# EAGLE design Driver Controls Board v1.4 (EAGLE 9.5.1)
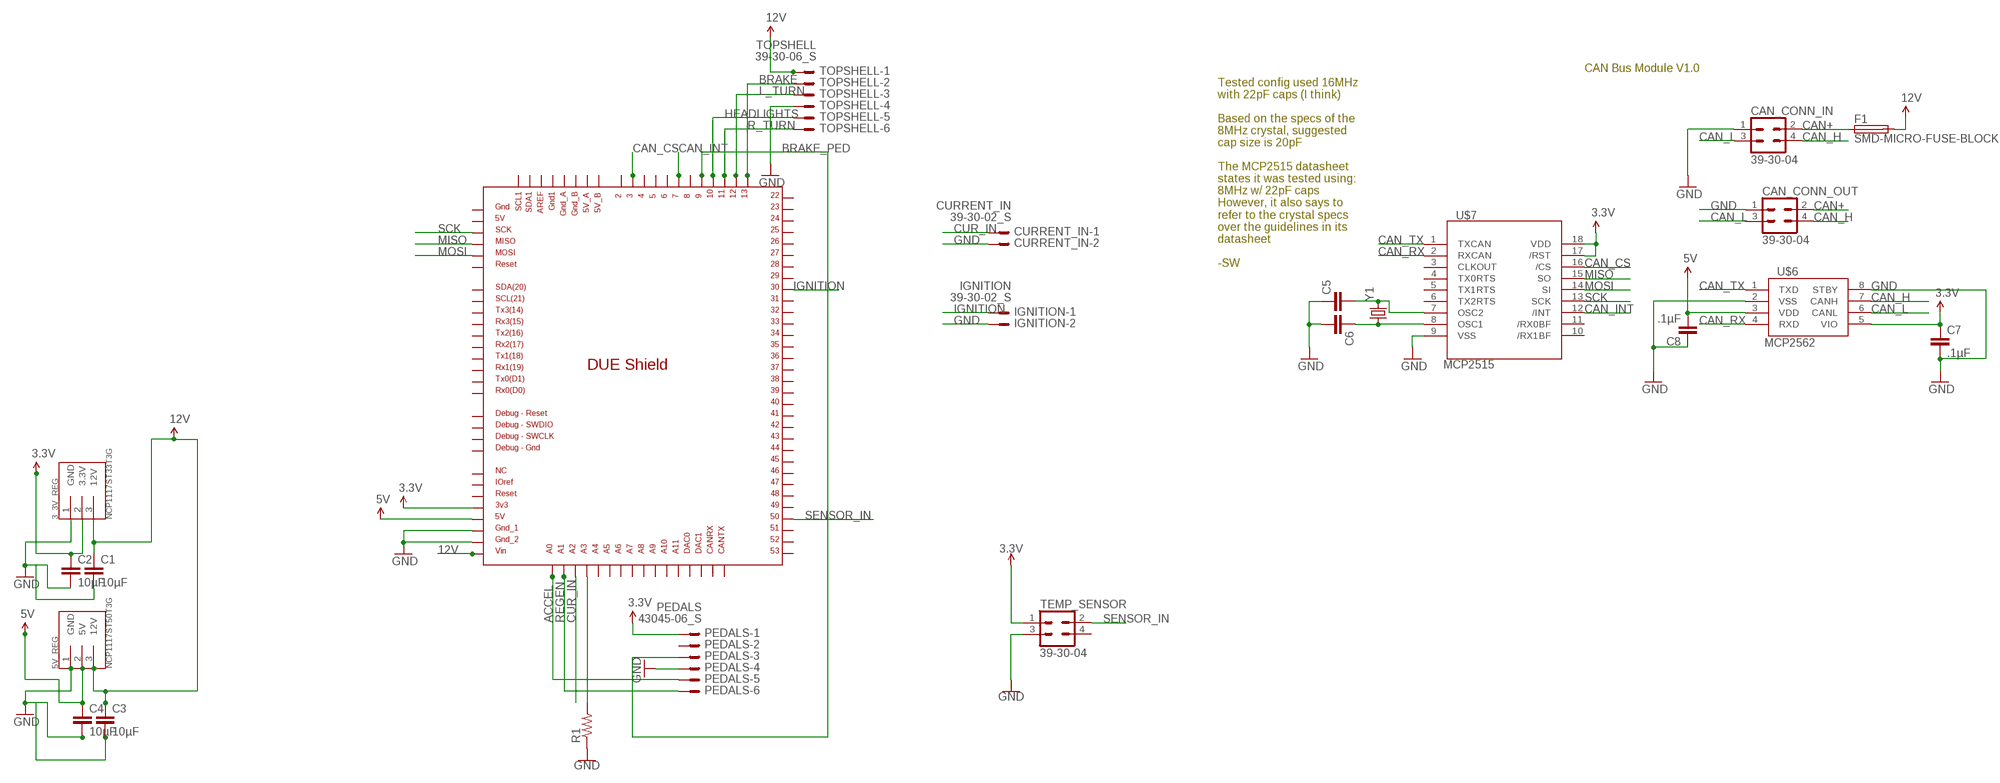
[diagram p0: schematic, sheet 1]

## Parts
3_3V_REG  NCP1117ST33T3G  [SOT223]
5V_REG  NCP1117ST50T3G  [SOT223]
C1  10µF  CAP0805  [0805]
C2  10µF  CAP0805  [0805]
C3  10µF  CAP0805  [0805]
C4  10µF  CAP0805  [0805]
C5  CAP0805  [0805]
C6  CAP0805  [0805]
C7  .1µF  CAP0805  [0805]
C8  .1µF  CAP0805  [0805]
CAN_CONN_IN  39-30-04  [39-30-?04?]
CAN_CONN_OUT  39-30-04  [39-30-?04?]
CURRENT_IN  39-30-02_S  [39-30-?02?]
F1  SMD-MICRO-FUSE-BLOCK  [OMNIBLOK]
IGNITION  39-30-02_S  [39-30-?02?]
PEDALS  43045-06_S  [43045-06]
R1  R-US_0204/5  [0204/5]
TEMP_SENSOR  39-30-04  [39-30-?04?]
TOPSHELL  39-30-06_S  [39-30-?06?]
U$2  DUE(NORMAL)  [DUE(NORMAL)]
U$6  MCP2562  [SOIC8]
U$7  MCP2515  [SO-18W]
Y1  CRYSTALHC49US  [HC49US]

## Nets
3.3V: 3_3V_REG.2(3.3V) C2.1 C7.1 PEDALS.1 TEMP_SENSOR.1 U$2.3V3 U$6.5(VIO) U$7.17(/RST) U$7.18(VDD)
5V: 5V_REG.2(5V) C4.1 C8.2 U$2.5V U$6.3(VDD)
12V: 3_3V_REG.3(12V) 5V_REG.3(12V) C1.1 C3.1 F1.P$2 TOPSHELL.1 U$2.VIN
ACCEL: PEDALS.5 U$2.A0
BRAKE: TOPSHELL.2 U$2.13
BRAKE_PED: PEDALS.3 U$2.9
CAN+: CAN_CONN_IN.2 CAN_CONN_OUT.2 F1.P$1
CAN_CS: U$2.3 U$7.16(/CS)
CAN_H: CAN_CONN_IN.4 CAN_CONN_OUT.4 U$6.7(CANH)
CAN_INT: U$2.7 U$7.12(/INT)
CAN_L: CAN_CONN_IN.3 CAN_CONN_OUT.3 U$6.6(CANL)
CAN_RX: U$6.4(RXD) U$7.2(RXCAN)
CAN_TX: U$6.1(TXD) U$7.1(TXCAN)
CUR_IN: CURRENT_IN.1 U$2.A2
GND: 3_3V_REG.1(GND) 5V_REG.1(GND) C1.2 C2.2 C3.2 C4.2 C5.1 C6.2 C7.2 C8.1 CAN_CONN_IN.1 CAN_CONN_OUT.1 CURRENT_IN.2 IGNITION.2 PEDALS.4 R1.1 TEMP_SENSOR.3 TOPSHELL.4 U$2.GND_1 U$2.GND_2 U$6.2(VSS) U$6.8(STBY) U$7.9(VSS)
HEADLIGHTS: TOPSHELL.5 U$2.10
IGNITION: IGNITION.1 U$2.30
L_TURN: TOPSHELL.3 U$2.12
MISO: U$2.MISO_ICSP U$7.15(SO)
MOSI: U$2.MOSI_ICSP U$7.14(SI)
N$1: R1.2 U$2.A3
N$7: C5.2 U$7.7(OSC2) Y1.2
N$11: C6.1 U$7.8(OSC1) Y1.1
R_TURN: TOPSHELL.6 U$2.11
REGEN: PEDALS.6 U$2.A1
SCK: U$2.SCK_ICSP U$7.13(SCK)
SENSOR_IN: TEMP_SENSOR.2 U$2.50
Unconnected: PEDALS.2 TEMP_SENSOR.4 U$2.2 U$2.4 U$2.5 U$2.5V_A U$2.5V_B U$2.5V_ICSP U$2.6 U$2.8 U$2.22 U$2.23 U$2.24 U$2.25 U$2.26 U$2.27 U$2.28 U$2.29 U$2.31 U$2.32 U$2.33 U$2.34 U$2.35 U$2.36 U$2.37 U$2.38 U$2.39 U$2.40 U$2.41 U$2.42 U$2.43 U$2.44 U$2.45 U$2.46 U$2.47 U$2.48 U$2.49 U$2.51 U$2.52 U$2.53 U$2.A4 U$2.A5 U$2.A6 U$2.A7 U$2.A8 U$2.A9 U$2.A10 U$2.A11 U$2.AREF U$2.CANRX U$2.CANTX U$2.DAC0 U$2.DAC1 U$2.GND1 U$2.GND_A U$2.GND_B U$2.GND_DEBUG U$2.GND_ICSP U$2.IOREF U$2.NC U$2.RESET U$2.RESET_DEBUG U$2.RESET_ICSP U$2.RX0 U$2.RX1 U$2.RX2 U$2.RX3 U$2.SCL U$2.SCL1 U$2.SDA U$2.SDA1 U$2.SWCLK_DEBUG U$2.SWDIO_DEBUG U$2.TX0 U$2.TX1 U$2.TX2 U$2.TX3 U$7.3(CLKOUT) U$7.4(TX0RTS) U$7.5(TX1RTS) U$7.6(TX2RTS) U$7.10(/RX1BF) U$7.11(/RX0BF)

## Notes on the sheet
- CAN Bus Module V1.0
- Tested config used 16MHz
  with 22pF caps (I think)
  
  Based on the specs of the
  8MHz crystal, suggested
  cap size is 20pF
  
  The MCP2515 datasheet
  states it was tested using:
  8MHz w/ 22pF caps
  However, it also says to
  refer to the crystal specs
  over the guidelines in its
  datasheet
  
  -SW

## Library data of the parts
3_3V_REG = NUSOLAR_Custom:NCP1117ST33T3G
5V_REG = NUSOLAR_Custom:NCP1117ST50T3G
C1-C8 = SparkFun-Capacitors:CAP: Capacitor Standard 0603 ceramic capacitor, and 0.1" leaded capacitor.
CAN_CONN_IN CAN_CONN_OUT TEMP_SENSOR = con-molex-mini-fit:39-30-?04?: HEADER
CURRENT_IN IGNITION = con-molex-mini-fit:39-30-?02?_S: HEADER
F1 = f-lf-omniblok-s:SMD-MICRO-FUSE
PEDALS = con-molex-micro-fit:43045-06_S: HEADER
R1 = resistor:R-US_: RESISTOR, American symbol
TOPSHELL = con-molex-mini-fit:39-30-?06?_S: HEADER
U$2 = DUElib130425:DUE(NORMAL)
U$6 = NUSOLAR_Custom:MCP2562
U$7 = NUSOLAR_Custom:MCP2515
Y1 = SparkFun-FreqCtrl:CRYSTAL: Various standard crystals. Proven footprints.

## Board
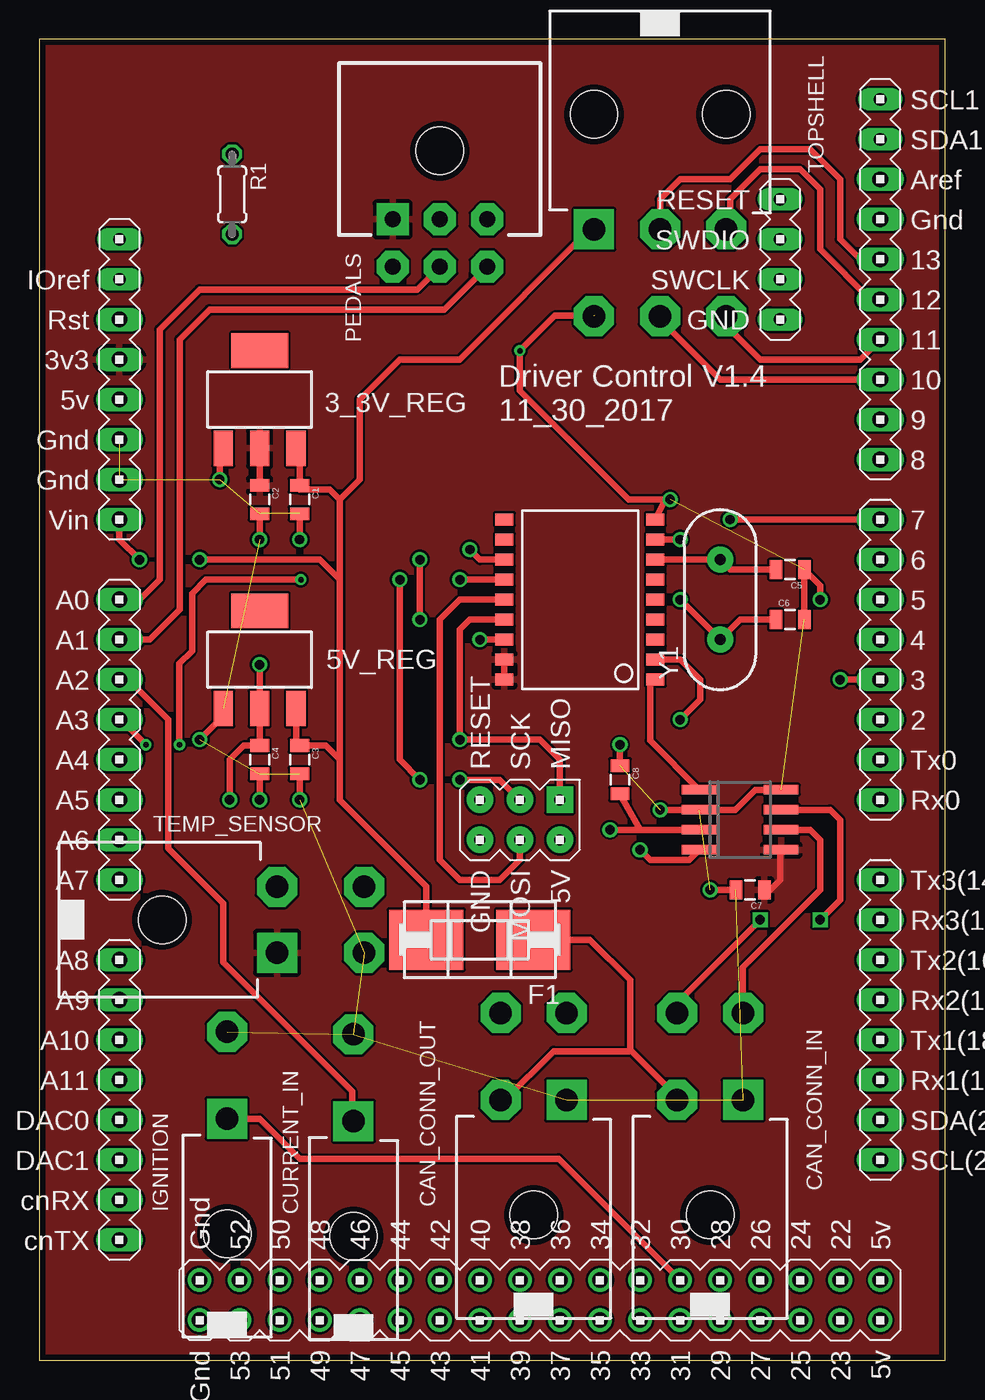
[diagram p1: board, top side]
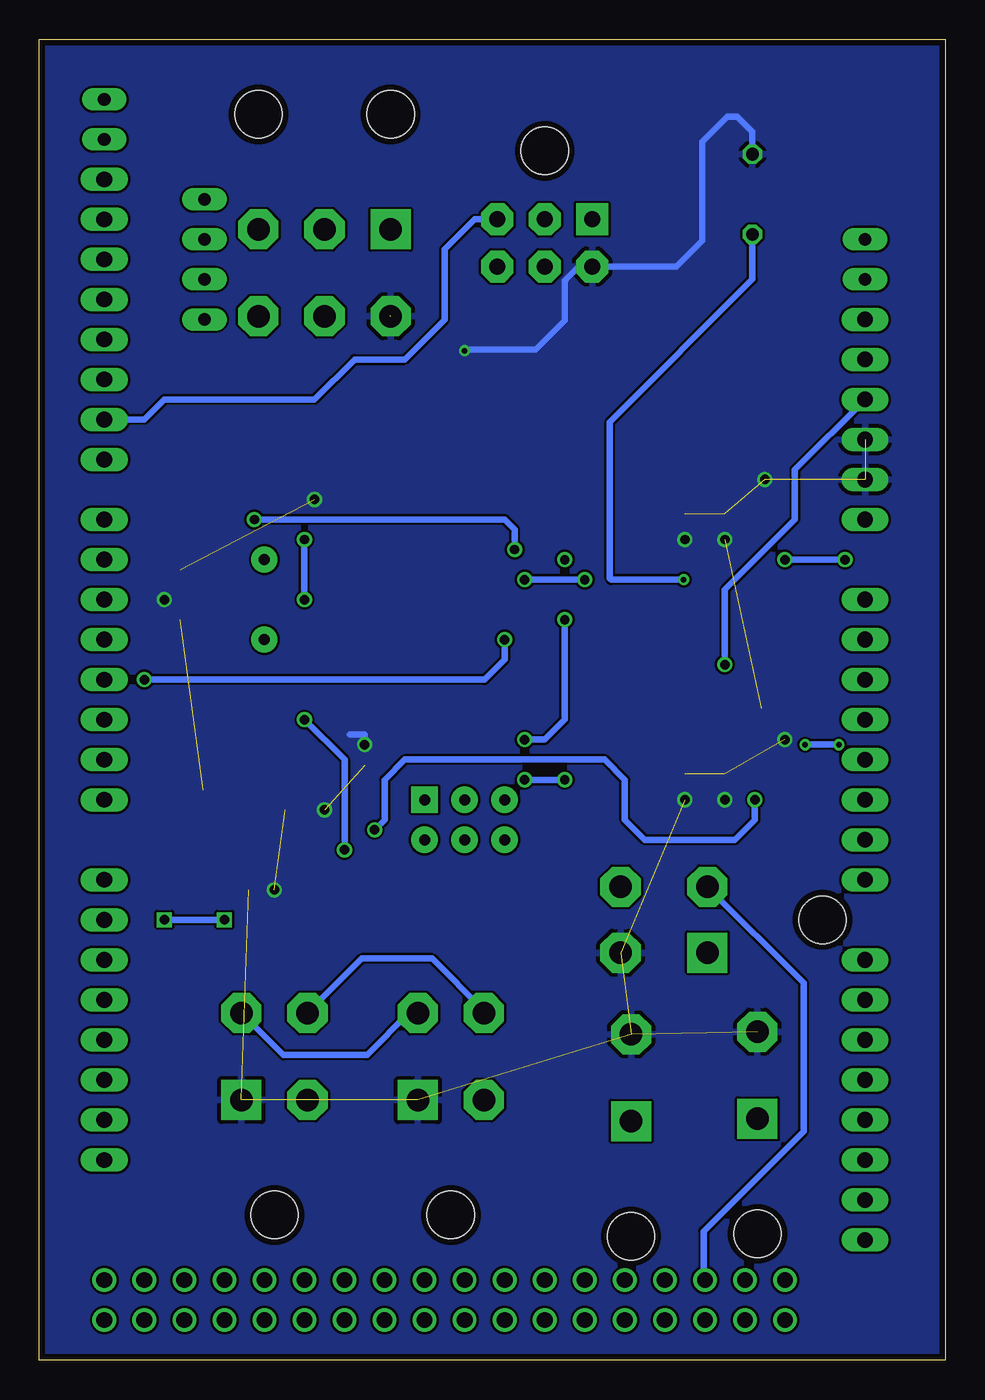
[diagram p2: board, bottom side, seen from below]

Size 57.45 x 83.81 mm. Coordinates in mm from the lower left corner, seen from the top.
Outline: 0,0 57.45,0 57.45,83.81 0,83.81 0,0
Copper layers (1*16): Top 0.0356mm / dielectric 1.5011mm / Bottom 0.0356mm
Design rules "LaenPCBOrder": minimum track width 6mil, minimum drill 13mil, track to track 6mil, track to pad 6mil, pad to pad 6mil, via to via 6mil, smd to smd 6mil, copper to edge 15mil, drill to drill 6mil, minimum pad ring 7mil, minimum via ring 7mil, stop-mask expansion 3mil, vias tented up to drill 0mil, thermal gap 10mil

### Footprints (pad centres in the part's own frame; a part is rotated, then mirrored left to right if it is on the bottom)
SOT223 = smd 1.219 x 2.235: 1 -2.311,-3.099; 2 0,-3.099; 3 2.311,-3.099 | smd 3.6 x 2.2: 4 0,3.099
0805 = smd 0.8 x 1.2: 1 -0.9,0; 2 0.9,0
39-30-?04? = drill 1.422 pad 2.54 square: 1 2.095,0 | drill 1.422 pad 2.54 octagon: 2 -2.095,0; 3 2.095,5.512; 4 -2.095,5.512 | hole 3: 0,-7.3
39-30-?02? = drill 1.422 pad 2.54 square: 1 0,0 | drill 1.422 pad 2.54 octagon: 2 0,5.512 | hole 3: 0,-7.3
OMNIBLOK = smd 4.7 x 3.8: P$1 -3.4,0; P$2 3.4,0
43045-06 = drill 1.016 pad 2.032 square: 1 3,0 | drill 1.016 pad 2.032 octagon: 2 0,0; 3 -3,0; 4 3,3; 5 0,3; 6 -3,3 | hole 3: 0,-4.35
0204/5 = drill 0.813 octagon: 1 -2.54,0; 2 2.54,0
39-30-?06? = drill 1.422 pad 2.54 square: 1 4.191,0 | drill 1.422 pad 2.54 octagon: 2 0,0; 3 -4.191,0; 4 4.191,5.512; 5 0,5.512; 6 -4.191,5.512 | hole 3: -4.191,-7.3; 4.191,-7.3
DUE(NORMAL) = drill 1 long: 2 -16.51,30.48; 3 -19.05,30.48; 3V3 -39.37,-17.78; 4 -21.59,30.48; 5 -24.13,30.48; 5V -36.83,-17.78; 6 -26.67,30.48; 7 -29.21,30.48; 8 -33.02,30.48; 9 -35.56,30.48; 10 -38.1,30.48; 11 -40.64,30.48; 12 -43.18,30.48; 13 -45.72,30.48; A0 -24.13,-17.78; A1 -21.59,-17.78; A2 -19.05,-17.78; A3 -16.51,-17.78; A4 -13.97,-17.78; A5 -11.43,-17.78; A6 -8.89,-17.78; A7 -6.35,-17.78; A8 -1.27,-17.78; A9 1.27,-17.78; A10 3.81,-17.78; A11 6.35,-17.78; AREF -50.8,30.48; CANRX 13.97,-17.78; CANTX 16.51,-17.78; DAC0 8.89,-17.78; DAC1 11.43,-17.78; GND1 -48.26,30.48; GND_1 -34.29,-17.78; GND_2 -31.75,-17.78; RESET -41.91,-17.78; RX0 -11.43,30.48; RX1 6.35,30.48; RX2 1.27,30.48; RX3 -3.81,30.48; SCL 11.43,30.48; SDA 8.89,30.48; TX0 -13.97,30.48; TX1 3.81,30.48; TX2 -1.27,30.48; TX3 -6.35,30.48; VIN -29.21,-17.78 | drill 1: 5V_A 19.05,30.48; 5V_B 21.59,30.48; 22 19.05,27.94; 23 21.59,27.94; 24 19.05,25.4; 25 21.59,25.4; 26 19.05,22.86; 27 21.59,22.86; 28 19.05,20.32; 29 21.59,20.32; 30 19.05,17.78; 31 21.59,17.78; 32 19.05,15.24; 33 21.59,15.24; 34 19.05,12.7; 35 21.59,12.7; 36 19.05,10.16; 37 21.59,10.16; 38 19.05,7.62; 39 21.59,7.62; 40 19.05,5.08; 41 21.59,5.08; 42 19.05,2.54; 43 21.59,2.54; 44 19.05,0; 45 21.59,0; 46 19.05,-2.54; 47 21.59,-2.54; 48 19.05,-5.08; 49 21.59,-5.08; 50 19.05,-7.62; 51 21.59,-7.62; 52 19.05,-10.16; 53 21.59,-10.16; GND_A 19.05,-12.7; GND_B 21.59,-12.7 | drill 0.7 pad 1.676: 5V_ICSP -8.89,5.08; GND_ICSP -8.89,10.16; MOSI_ICSP -8.89,7.62; RESET_ICSP -11.43,5.08; SCK_ICSP -11.43,7.62 | drill 0.8 pad 1.422 long: GND_DEBUG -41.91,24.13; IOREF -44.45,-17.78; NC -46.99,-17.78; RESET_DEBUG -49.53,24.13; SCL1 -55.88,30.48; SDA1 -53.34,30.48; SWCLK_DEBUG -44.45,24.13; SWDIO_DEBUG -46.99,24.13 | drill 0.7 pad 1.676 square: MISO_ICSP -11.43,10.16
SOIC8 = smd 0.6 x 2.2: 1 -1.905,-2.6; 2 -0.635,-2.6; 3 0.635,-2.6; 4 1.905,-2.6; 5 1.905,2.6; 6 0.635,2.6; 7 -0.635,2.6; 8 -1.905,2.6
SO-18W = smd 0.762 x 1.143: 1 -5.08,-4.788; 2 -3.81,-4.788; 3 -2.54,-4.788; 4 -1.27,-4.788; 5 0,-4.788; 6 1.27,-4.788; 7 2.54,-4.788; 8 3.81,-4.788; 9 5.08,-4.788; 10 5.08,4.788; 11 3.81,4.788; 12 2.54,4.788; 13 1.27,4.788; 14 0,4.788; 15 -1.27,4.788; 16 -2.54,4.788; 17 -3.81,4.788; 18 -5.08,4.788
HC49US = drill 0.7 pad 1.651: 1 -2.54,0; 2 2.54,0

### Placement (x,y rotation side)
3_3V_REG  13.97,60.96 0 top
5V_REG  13.97,44.45 0 top
C1  16.51,54.61 270 top
C2  13.97,54.61 270 top
C3  16.51,38.1 270 top
C4  13.97,38.1 270 top
C5  47.62,50.16 180 top
C6  47.62,46.99 0 top
C7  45.09,29.84 180 top
C8  36.83,36.83 270 top
CAN_CONN_IN  39-30-04?  [39-30-?04?]  42.55,16.51 0 top
CAN_CONN_OUT  39-30-04?  [39-30-?04?]  31.35,16.51 0 top
CURRENT_IN  39-30-02?_S  [39-30-?02?]  19.92,15.16 0 top
F1  27.94,26.67 180 top
IGNITION  39-30-02?_S  [39-30-?02?]  11.91,15.32 0 top
PEDALS  25.4,72.39 180 top
R1  12.22,73.98 270 top
TEMP_SENSOR  39-30-04?  [39-30-?04?]  15.08,27.94 270 top
TOPSHELL  39-30-06?_S  [39-30-?06?]  39.37,71.75 180 top
U$2  22.86,24.13 270 top
U$6  44.45,34.29 270 top
U$7  34.29,48.26 90 top
Y1  43.18,48.26 90 top

### Tracks (layer width: path | path; a pad name or v marks a point on that pad's centre or on a via)
3.3V
  Top 0.406: 3_3V_REG.2 C2.1 | U$7.17 U$7.18 | U$6.5 46.99,32.33 46.99,30.48 46.36,29.84 C7.1
  pour Top: 0,83.82 57.15,83.82 57.15,82.55 57.15,0 0,0
5V  (via drill 0.6)
  Top 0.406: 38.1,33.66 v36.2,33.66 | U$6.3 38.1,33.66 | 38.1,33.66 C8.2 | v12.06,35.56 12.06,38.1 12.96,39 C4.1 5V_REG.2 v13.97,44.13
  Bottom 0.406: v12.06,35.56 12.06,34.29 13.33,33.02 19.05,33.02 20.32,34.29 20.32,36.83 21.59,38.1 34.29,38.1 35.56,36.83 35.56,34.29 v36.2,33.66 | U$2.5V 9.53,56.52 9.53,53.34 13.97,48.9 v13.97,44.13
12V  (via drill 0.6)
  Top 0.406: 3_3V_REG.3 16.51,57.86 C1.1 16.51,55.24 18.41,55.24 19.05,54.61 | v10.16,50.8 17.78,50.8 19.05,49.53 | 19.05,49.53 19.05,38.1 | 19.05,38.1 19.05,35.56 24.54,30.07 F1.P$2 | 19.05,54.61 19.05,49.53 | 19.05,38.1 18.15,39 C3.1 16.28,39.23 5V_REG.3 | v6.35,50.8 5.08,52.07 U$2.VIN | 19.05,54.61 20.32,55.88 20.32,60.96 22.86,63.5 26.67,63.5 34.93,71.75 TOPSHELL.1
  Bottom 0.406: v10.16,50.8 v6.35,50.8
ACCEL
  Top 0.406: U$2.A0 6.35,48.26 7.62,49.53 7.62,65.41 10.16,67.94 23.95,67.94 PEDALS.5
BRAKE
  Top 0.406: U$2.13 52.07,69.85 50.8,71.12 50.8,74.93 48.9,76.83 45.72,76.83 43.81,74.93 40.64,74.93 39.37,73.66 TOPSHELL.2
BRAKE_PED
  Bottom 0.406: U$2.9 50.8,59.69 49.53,60.96 40.01,60.96 37.47,63.5 34.29,63.5 31.75,66.04 31.75,70.48 29.84,72.39 PEDALS.3
CAN+
  Top 0.406: CAN_CONN_IN.2 40.45,16.7 37.47,19.68 | 37.47,19.68 37.47,24.13 34.93,26.67 F1.P$1 | CAN_CONN_OUT.2 29.53,16.51 32.62,19.61 37.39,19.61 37.47,19.68
CAN_CS  (via drill 0.6)
  Top 0.406: U$7.16 v27.94,45.72 | v50.8,43.18 U$2.3
  Bottom 0.406: v27.94,45.72 27.94,44.45 29.21,43.18 v50.8,43.18
CAN_H  (via drill 0.6)
  Top 0.406: U$6.7 50.17,34.92 50.8,34.29 50.8,29.21 v49.53,27.94 | CAN_CONN_IN.4 40.45,22.67 v45.72,27.94
  Bottom 0.406: v45.72,27.94 v49.53,27.94 | CAN_CONN_OUT.4 29.26,22.19 32.54,25.48 36.99,25.48 CAN_CONN_IN.4
CAN_INT  (via drill 0.6)
  Top 0.406: U$7.12 27.94,50.8 v27.3,51.44 | v43.81,53.34 U$2.7
  Bottom 0.406: v27.3,51.44 27.3,52.7 27.94,53.34 v43.81,53.34
CAN_L
  Top 0.406: U$6.6 48.9,33.66 49.53,33.02 49.53,29.84 44.61,24.92 44.61,22.05 CAN_CONN_IN.3
  Bottom 0.406: CAN_CONN_OUT.3 34.02,22.02 36.67,19.37 41.99,19.37 CAN_CONN_IN.3
CAN_RX  (via drill 0.6)
  Top 0.406: U$7.2 40.64,44.45 41.91,43.18 41.91,41.91 v40.64,40.64 | v38.1,32.38 38.73,31.75 41.22,31.75 U$6.4
  Bottom 0.406: v40.64,40.64 38.1,38.1 v38.1,32.38
CAN_TX
  Top 0.406: U$7.1 38.73,43.18 38.73,39.31 U$6.1
CUR_IN
  Top 0.406: U$2.A2 5.64,43.18 8.18,40.64 8.18,32.46 11.67,28.97 11.67,25.24 19.84,17.07 19.84,15.24 CURRENT_IN.1
GND  (via drill 0.35, 0.6)  (18 unrouted)
  Top 0.152: 35.24,56.75 35.18,56.82
  Top 0.406: 3_3V_REG.1 11.43,57.63 v11.43,55.88 | C4.2 v13.97,35.56 | C3.2 v16.51,35.56 | v39.37,34.92 U$6.2 44.13,34.92 45.4,36.2 U$6.8 | C6.2 C5.1 49.53,49.16 v49.53,48.26 | C7.2 v42.55,29.84 | U$7.9 39.71,54.61 v40.01,54.61 37.39,54.61 35.24,56.75 30.48,61.52 v30.48,64.06 32.7,66.28 35.24,66.28 | 5V_REG.1 11.66,40.87 v10.16,39.37 | C2.2 v13.97,52.07 | C1.2 v16.51,52.07 | C8.1 v36.83,39.05
  Bottom 0.152: 22.38,69.37 PEDALS.4 | 30.4,64.14 v30.48,64.06
  Bottom 0.406: v36.83,39.05 36.83,39.69 37.78,39.69 | R1.1 12.22,77.95 13.18,78.9 13.81,78.9 15.4,77.31 15.4,71.04 17.07,69.37 22.38,69.37 | PEDALS.4 23.24,69.39 24.13,68.5 24.13,65.96 25.96,64.14 30.4,64.14
  pour Bottom: 0,83.82 57.15,83.82 57.15,64.77 57.15,0 0,0
HEADLIGHTS
  Top 0.406: U$2.10 43.18,62.23 39.37,66.04 TOPSHELL.5
IGNITION
  Top 0.406: U$2.30 32.94,12.78 16.51,12.78 13.97,15.32 IGNITION.1
L_TURN
  Top 0.406: U$2.12 52.7,67.31 49.53,70.48 49.53,74.3 48.26,75.56 45.72,75.56 43.81,73.66 43.81,72.01 TOPSHELL.3
MISO  (via drill 0.6)
  Top 0.406: v24.13,46.99 v24.13,50.8 | U$7.15 27.3,46.99 26.67,46.35 v26.67,39.37 31.75,39.37 33.02,38.1 U$2.MISO_ICSP
  Bottom 0.406: v26.67,39.37 25.4,39.37 24.13,40.64 v24.13,46.99
MOSI
  Top 0.406: U$2.MOSI_ICSP 30.48,31.75 29.21,30.48 26.67,30.48 25.4,31.75 25.4,46.99 26.67,48.26 U$7.14
N$1  (via drill 0.35)
  Top 0.406: U$2.A3 5.16,40.64 v6.75,39.05 | v8.88,39.05 8.88,44.21 9.68,45.01 9.68,48.66 10.56,49.53 v16.59,49.53
  Bottom 0.152: 21.19,49.53 21.27,49.61
  Bottom 0.406: v16.59,49.53 21.19,49.53 | 21.27,49.61 21.27,59.53 12.22,68.58 R1.2 | v6.75,39.05 v8.88,39.05
N$7
  Top 0.406: U$7.7 Y1.2 43.81,50.16 C5.2
N$11  (via drill 0.6)
  Top 0.406: v40.64,48.26 Y1.1 44.45,46.99 C6.1 | v40.64,52.07 U$7.8
  Bottom 0.406: v40.64,48.26 v40.64,52.07
R_TURN
  Top 0.406: U$2.11 52.07,63.5 45.72,63.5 43.56,65.66 TOPSHELL.6
REGEN
  Top 0.406: U$2.A1 6.98,45.72 8.89,47.62 8.89,64.77 10.79,66.67 25.69,66.67 PEDALS.6
SCK  (via drill 0.6)
  Top 0.406: v26.67,49.53 U$7.13 | U$2.SCK_ICSP 29.21,36.83 v26.67,36.83 | v24.13,36.83 22.86,38.1 v22.86,49.53
  Bottom 0.406: v22.86,49.53 v26.67,49.53 | v26.67,36.83 v24.13,36.83
SENSOR_IN
  Bottom 0.406: U$2.50 15.32,5.16 15.32,8.18 8.97,14.53 8.97,23.92 TEMP_SENSOR.2

### Text on the board
tNames: 3_3V_REG | Driver Control V1.4 / 11_30_2017